# Altium schematic sheet SNR8016VR-M.SchDoc
size A4
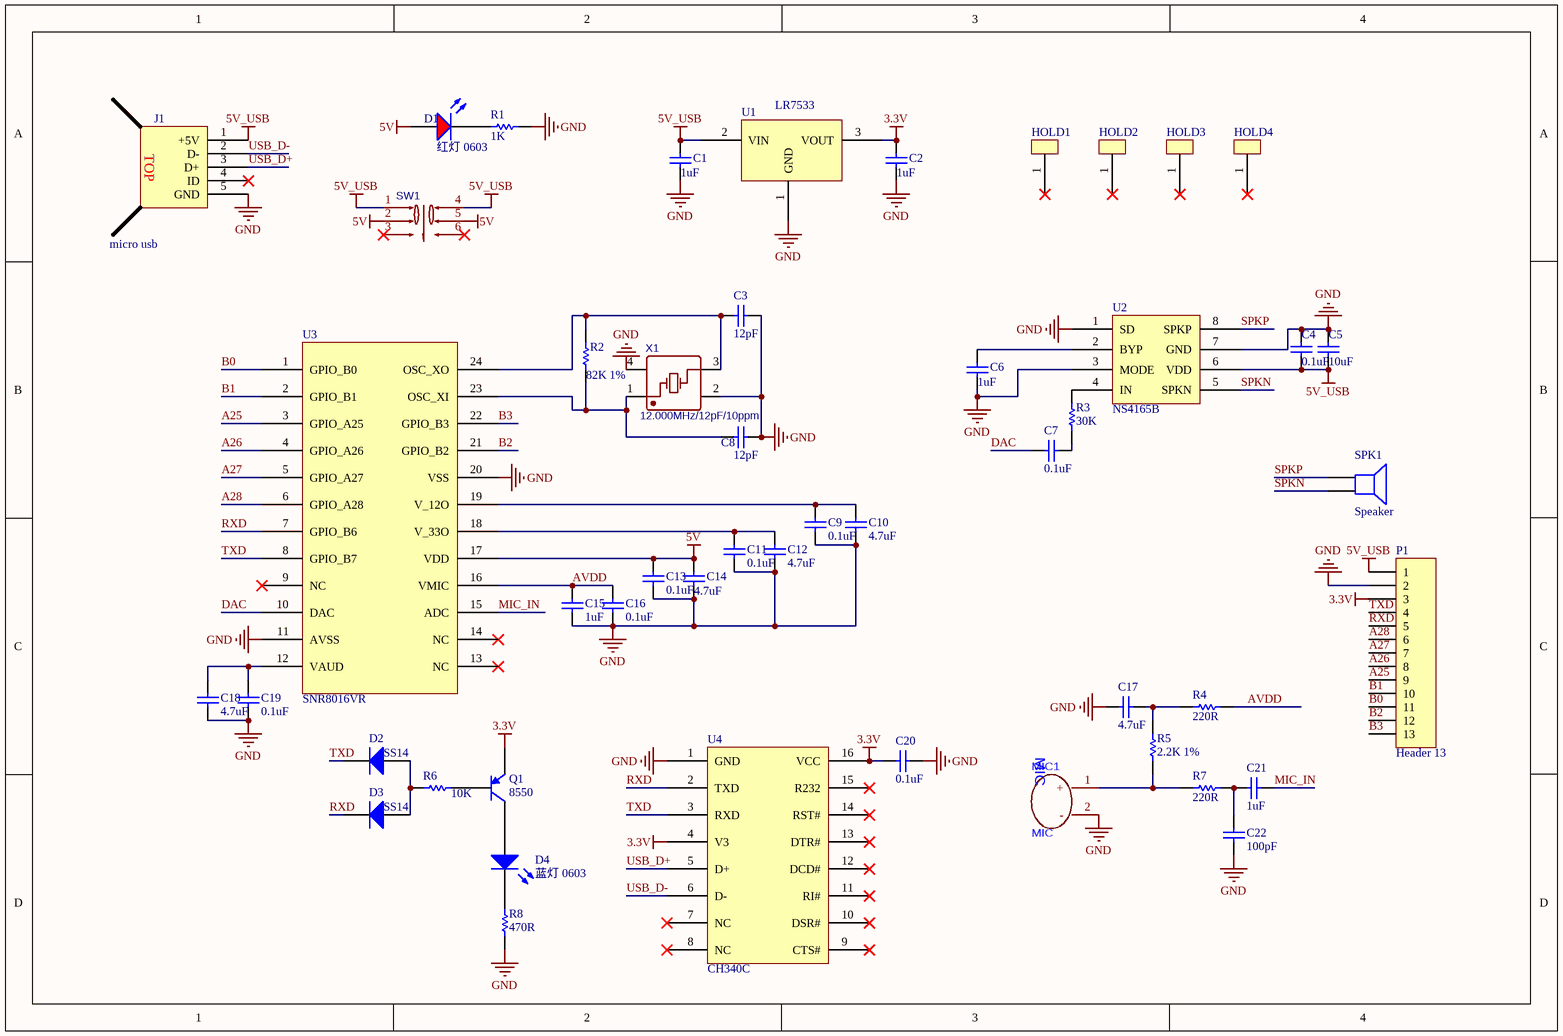
[diagram p0: SNR8016VR-M.SchDoc]

## Parts
C1  value 1uF  [C0603_small]  (hidden comment: Cap)
C2  value 1uF  [C0603_small]  (hidden comment: Cap)
C3  value 12pF  [C0603_small]  (hidden comment: Cap)
C4  value 0.1uF  [C0603_small]  (hidden comment: Cap)
C5  value 10uF  [C0603_small]  (hidden comment: Cap)
C6  value 1uF  [C0603_small]  (hidden comment: Cap)
C7  value 0.1uF  [C0603_small]  (hidden comment: Cap)
C8  value 12pF  [C0603_small]  (hidden comment: Cap)
C9  value 0.1uF  [C0603_small]  (hidden comment: Cap)
C10  value 4.7uF  [C0603_small]  (hidden comment: Cap)
C11  value 0.1uF  [C0603_small]  (hidden comment: Cap)
C12  value 4.7uF  [C0603_small]  (hidden comment: Cap)
C13  value 0.1uF  [C0603_small]  (hidden comment: Cap)
C14  value 4.7uF  [C0603_small]  (hidden comment: Cap)
C15  value 1uF  [C0603_small]  (hidden comment: Cap)
C16  value 0.1uF  [C0603_small]  (hidden comment: Cap)
C17  4.7uF  [C0603_small]
C18  value 4.7uF  [C0603_small]  (hidden comment: Cap)
C19  value 0.1uF  [C0603_small]  (hidden comment: Cap)
C20  value 0.1uF  [C0603_small]  (hidden comment: Cap)
C21  1uF  [C0603_small]
C22  100pF  [C0603_small]
D1  红灯 0603  [0603_LED_S1]
D2  SS14  [SOD-123]
D3  SS14  [SOD-123]
D4  蓝灯 0603  [0603_LED_S1]
HOLD1  TEST POINT  [HOLD330-600]  (value not drawn)
HOLD2  TEST POINT  [HOLD330-600]  (value not drawn)
HOLD3  TEST POINT  [HOLD330-600]  (value not drawn)
HOLD4  TEST POINT  [HOLD330-600]  (value not drawn)
J1  micro usb  [MICRO-USB-SMD_5P-P0.65-H-M_MICRO-USB-5P]
MIC1  MIC  [MIC_9767]
P1  Header 13  [Header 1*13P 2.54mm]
Q1  8550  [SOT-23 - PNP]
R1  value 1K  [R0603_small]  (hidden comment: Res1)
R2  value 82K 1%  [R0603_small]  (hidden comment: Res1)
R3  value 30K  [R0603_small]  (hidden comment: Res1)
R4  value 220R  [R0603_small]  (hidden comment: Res1)
R5  value 2.2K 1%  [R0603_small]  (hidden comment: Res1)
R6  value 10K  [R0603_small]  (hidden comment: Res1)
R7  value 220R  [R0603_small]  (hidden comment: Res1)
R8  value 470R  [R0603_small]  (hidden comment: Res1)
SPK1  Speaker  [SPEAKER_2308]
SW1  SW_XKB5858-W-TP  [SW-SMD_6P-L5.8-W5.8-P2.00-LS8.3]  (value not drawn)
U1  LR7533  [SOT-89]
U2  NS4165B  [NS4165]
U3  SNR8016VR  [QSOP-24_L8.7-W4.0-P0.65-LS6.0-BL]
U4  CH340C  [SOP-16_150mil]
X1  12.000MHz/12pF/10ppm  [CY3225-4]

## Nets
3.3V: C2.2 C20.2 P1.3 Q1.3(E) U1.3(VOUT) U4.4(V3) U4.16(VCC)
5V: C13.2 C14.2 D1.A SW1.2 SW1.5 U3.17(VDD)
5V_USB: C1.2 C4.2 C5.1 J1.1(+5V) P1.1 SW1.1 SW1.4 U1.2(VIN) U2.6(VDD)
GND: C1.1 C2.1 C3.1 C4.1 C5.2 C6.1 C8.1 C9.1 C10.1 C11.1 C12.1 C13.1 C14.1 C15.1 C16.1 C17.2 C18.1 C19.1 C20.1 C22.1 J1.5(GND) MIC1.2(-) P1.2 R1.2 R8.1 U1.1(GND) U2.1(SD) U2.3(MODE) U2.7(GND) U3.11(AVSS) U3.20(VSS) U4.1(GND) X1.2(GND) X1.4(GND)
A25: P1.9 U3.3(GPIO_A25)
A26: P1.8 U3.4(GPIO_A26)
A27: P1.7 U3.5(GPIO_A27)
A28: P1.6 U3.6(GPIO_A28)
AVDD: C15.2 C16.2 R4.1 U3.16(VMIC)
B0: P1.11 U3.1(GPIO_B0)
B1: P1.10 U3.2(GPIO_B1)
B2: P1.12 U3.21(GPIO_B2)
B3: P1.13 U3.22(GPIO_B3)
DAC: C7.1 U3.10(DAC)
MIC_IN: C21.1 U3.15(ADC)
RXD: D3.2(K) P1.5 U3.7(GPIO_B6) U4.2(TXD)
SPKN: SPK1.2 U2.5(SPKN)
SPKP: SPK1.1 U2.8(SPKP)
TXD: D2.2(K) P1.4 U3.8(GPIO_B7) U4.3(RXD)
USB_D+: J1.3(D+) U4.5(D+)
USB_D-: J1.2(D-) U4.6(D-)
NetC3_2: C3.2 R2.2 U3.24(OSC_XO) X1.3(OUT)
NetC6_2: C6.2 U2.2(BYP)
NetC7_2: C7.2 R3.2
NetC8_2: C8.2 R2.1 U3.23(OSC_XI) X1.1(OE#)
NetC9_2: C9.2 C10.2 U3.19(V_12O)
NetC11_2: C11.2 C12.2 U3.18(V_33O)
NetC17_1: C17.1 R4.2 R5.1
NetC18_2: C18.2 C19.2 U3.12(VAUD)
NetC21_2: C21.2 C22.2 R7.1
NetD1_K: D1.K R1.1
NetD2_1: D2.1(A) D3.1(A) R6.1
NetD4_A: D4.A Q1.1(C)
NetD4_K: D4.K R8.2
NetMIC1_1: MIC1.1(+) R5.2 R7.2
NetQ1_2: Q1.2(B) R6.2
NetR3_1: R3.1 U2.4(IN)

Not connected (* = marked no-connect by the designer): HOLD1 1(VOUT)*; HOLD2 1(VOUT)*; HOLD3 1(VOUT)*; HOLD4 1(VOUT)*; J1 4(ID)*; SW1 3* 6*; U3 9(NC)* 13(NC)* 14(NC)*; U4 7(NC)* 8(NC)* 9(CTS#)* 10(DSR#)* 11(RI#)* 12(DCD#)* 13(DTR#)* 14(RST#)* 15(R232)*

## Notes on the sheet
- (in symbol micro usb) TOP

## Library data of the parts
C1-C16 C18-C20 = Cap: Capacitor; Published: 8-Jun-2000; LatestRevisionDate: 17-Jul-2002; LatestRevisionNote: Re-released for DXP Platform.; PackageReference: RAD-0.3; Publisher: Altium Limited; PackageDescription: Radial Cap, Thru-Hole; 2 Leads; 0.3 in Pin Spacing
C17 = 0603 1uF (105) 10% 50V: 贴片电容; ComponentLink1Description: 供应商链接; ComponentLink1URL: http://www.szlcsc.com/product/details_16531.html; Package: 0603; Supplier: LC; SuppliersPartNumber: C15849
C21 C22 = 0402 2.7pF (2R7) 0.25pF 50V: 贴片电容; ComponentLink1Description: 供应商链接; ComponentLink1URL: http://www.szlcsc.com/product/details_1913.html; Package: 0402; Supplier: LC; SuppliersPartNumber: C1561
D1 = 0603 红灯: 发光二极管; ComponentLink1Description: 供应商链接; ComponentLink1URL: http://www.szlcsc.com/product/details_2659.html; Package: 0603; Supplier: LC; SuppliersPartNumber: C2286
D2 D3 = Diode: Default Diode; Published: 8-Jun-2000; LatestRevisionDate: 17-Jul-2002; LatestRevisionNote: Re-released for DXP Platform.; PackageVersion: Sep-1996; PackageReference: SMC; Publisher: Altium Limited; PackageDescription: DO-214-AB/SMC; 2 C-Bend Leads; Body 7.9 x 5.9 mm, inc. leads (LxW); Code_JEDEC: DO-214-AB
D4 = 0603 蓝灯: 发光二极管; ComponentLink1Description: 供应商链接; ComponentLink1URL: http://www.szlcsc.com/product/details_73150.html; Package: 0603; Supplier: LC; SuppliersPartNumber: C72041
P1 = Header 13: Header, 13-Pin; LatestRevisionDate: 17-Jul-2002; LatestRevisionNote: Re-released for DXP Platform.; Publisher: Altium Limited
Q1 = PNP: PNP Bipolar Transistor; Published: 8-Jun-2000; LatestRevisionDate: 29-May-2009; LatestRevisionNote: IPC-7351 Footprint Added.; PackageVersion: Aug-1999; PackageReference: SOT-23B; Publisher: Altium Limited; PackageDescription: 3-Pin SOT-23 Package 0.95 mm Pitch, 2.4 mm Lead Span
R1-R8 = Res1: Resistor; Published: 8-Jun-2000; LatestRevisionDate: 17-Jul-2002; LatestRevisionNote: Re-released for DXP Platform.; PackageReference: AXIAL-0.3; Publisher: Altium Limited; PackageDescription: Axial Device, Thru-Hole; 2 Leads; 0.3 in Pin Spacing
SPK1 = Speaker: Loudspeaker; Published: 24-Mar-1999; LatestRevisionDate: 17-Jul-2002; LatestRevisionNote: Re-released for DXP Platform.; PackageReference: PIN2; Publisher: Altium Limited
SW1 = SW_XKB5858-W-TP: BOM_Manufacturer: XKB Enterprise; Contributor: LCSC; BOM_Supplier: LCSC; BOM_Supplier Part: C381091; BOM_Manufacturer Part: XKB5858-W-TP; BOM_JLCPCB Part Class: Extended Part; spicePre: S; spiceSymbolName: XKB5858-W-TP
U2 = NS4165
X1 = 12.000MHz: BOM_Manufacturer: Zhejiang Abel Elec; BOM_Manufacturer Part: SMD-3225_4P 12.288MHZ 12PF; nameAlias: Frequency; Contributor: LCSC; SMT Type: Extend; BOM_Supplier: LCSC; BOM_Supplier Part: C362472; BOM_LCSC Assembly: Yes; spicePre: X; spiceSymbolName: SMD-3225_4P 12.288MHZ 12PF